# EAGLE design lora-pi-hat (EAGLE 9.5.2)
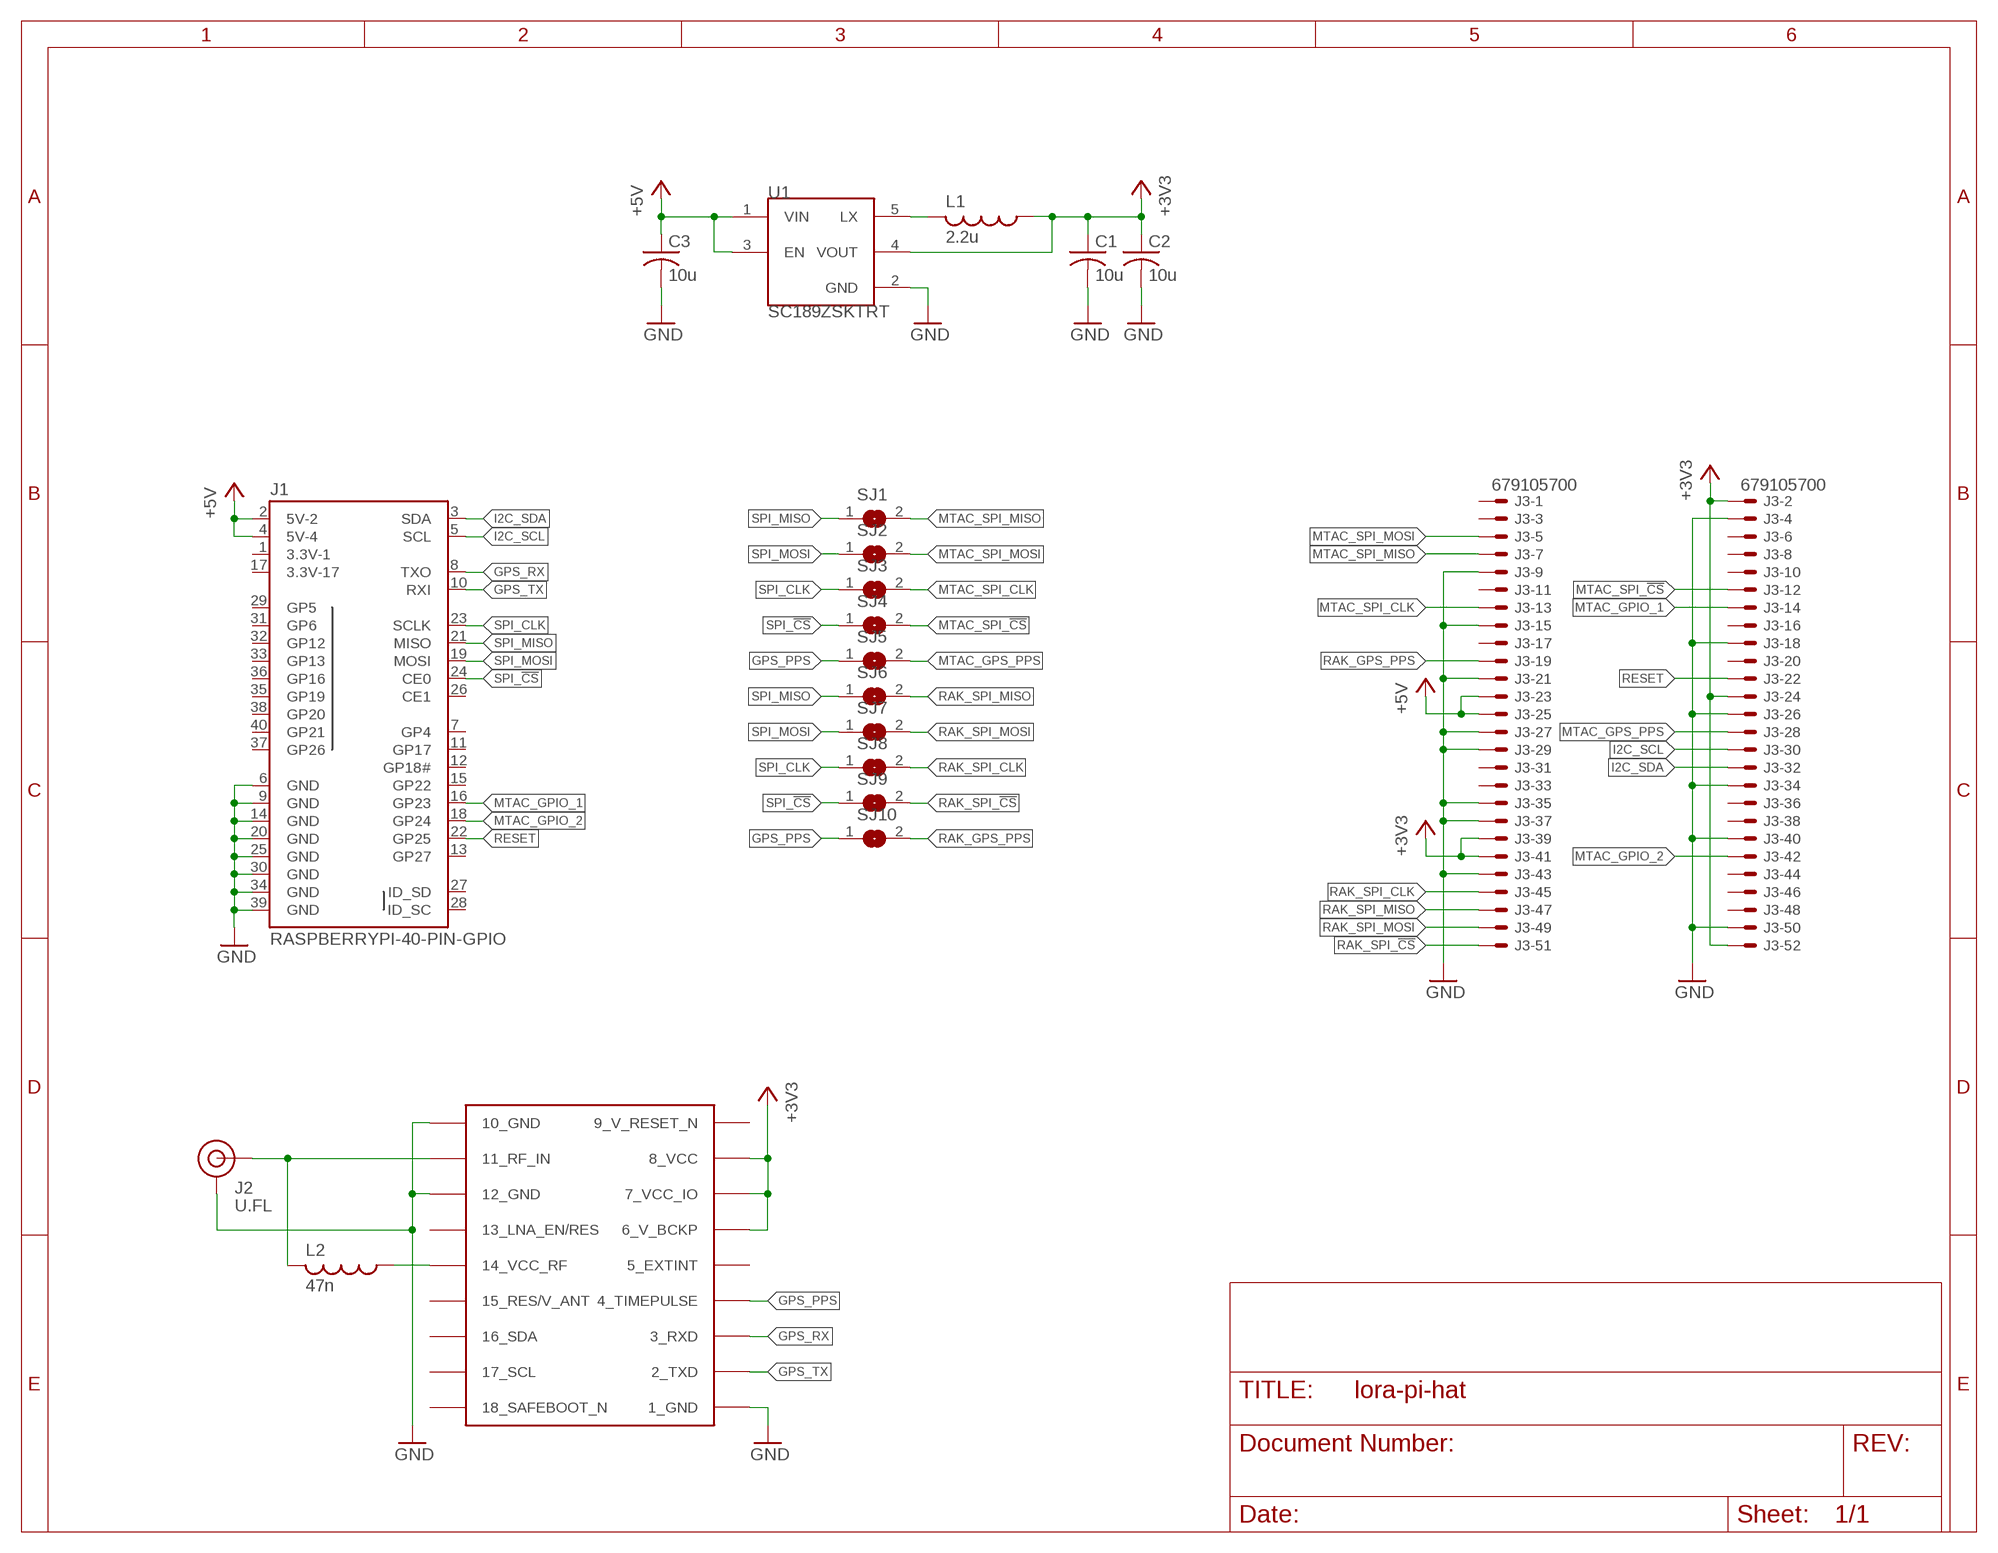
[diagram p0: schematic, sheet 1]

## Parts
C1  10u  C-US-0805  [CAPC2012X125N]
C2  10u  C-US-0805  [CAPC2012X125N]
C3  10u  C-US-0805  [CAPC2012X125N]
J1  RASPBERRYPI-40-PIN-GPIO  RASPBERRYPI-40-PIN-GPIO_PTH_NO_SHROUD  [2X20]
J2  U.FL  U.FL2PIN  [U.FL]
J3  679105700  [679105700]
L1  2.2u  L-US-1210  [INDC3225X250N]
L2  47n  L-US-0805  [INDC2012X125N]
SJ1  SJ  [SJ]
SJ2  SJ  [SJ]
SJ3  SJ  [SJ]
SJ4  SJ  [SJ]
SJ5  SJ  [SJ]
SJ6  SJ  [SJ]
SJ7  SJ  [SJ]
SJ8  SJ  [SJ]
SJ9  SJ  [SJ]
SJ10  SJ  [SJ]
U1  SC189ZSKTRT  [SOT95P280X120-5N]
U2  MAX-M8  [MAX-M8]

## Nets
+3V3 [pwr]: C1.1 C2.1 J3.2 J3.24 J3.39 J3.41 J3.52 L1.1 U1.4(VOUT) U2.6_V_BCKP U2.7_VCC_IO U2.8_VCC
+5V [pwr]: C3.1 J1.2(5V-2) J1.4(5V-4) J3.23 J3.25 U1.1(VIN) U1.3(EN)
GND: C1.2 C2.2 C3.2 J1.6(GND) J1.9(GND) J1.14(GND) J1.20(GND) J1.25(GND) J1.30(GND) J1.34(GND) J1.39(GND) J2.1(GND) J2.2(GND) J3.4 J3.9 J3.15 J3.18 J3.21 J3.26 J3.27 J3.29 J3.34 J3.35 J3.37 J3.40 J3.43 J3.50 U1.2(GND) U2.1_GND U2.10_GND U2.12_GND
GPS_PPS: SJ5.1 SJ10.1 U2.4_TIMEPULSE
GPS_RX: J1.8(TXO) U2.3_RXD
GPS_TX: J1.10(RXI) U2.2_TXD
I2C_SCL: J1.5(SCL) J3.30
I2C_SDA: J1.3(SDA) J3.32
MTAC_GPIO_1: J1.16(GP23) J3.14
MTAC_GPIO_2: J1.18(GP24) J3.42
MTAC_GPS_PPS: J3.28 SJ5.2
MTAC_SPI_!CS: J3.12 SJ4.2
MTAC_SPI_CLK: J3.13 SJ3.2
MTAC_SPI_MISO: J3.7 SJ1.2
MTAC_SPI_MOSI: J3.5 SJ2.2
N$3: L1.2 U1.5(LX)
N$4: L2.1 U2.14_VCC_RF
N$5: J2.FEED(SIGNAL) L2.2 U2.11_RF_IN
RAK_GPS_PPS: J3.19 SJ10.2
RAK_SPI_!CS: J3.51 SJ9.2
RAK_SPI_CLK: J3.45 SJ8.2
RAK_SPI_MISO: J3.47 SJ6.2
RAK_SPI_MOSI: J3.49 SJ7.2
RESET: J1.22(GP25) J3.22
SPI_!CS: J1.24(CE0) SJ4.1 SJ9.1
SPI_CLK: J1.23(SCLK) SJ3.1 SJ8.1
SPI_MISO: J1.21(MISO) SJ1.1 SJ6.1
SPI_MOSI: J1.19(MOSI) SJ2.1 SJ7.1
Unconnected: J1.7(GP4) J1.11(GP17) J1.12(GP18#) J1.13(GP27) J1.15(GP22) J1.26(CE1) J1.27(ID_SD) J1.28(ID_SC) J1.29(GP5) J1.31(GP6) J1.32(GP12) J1.33(GP13) J1.35(GP19) J1.36(GP16) J1.37(GP26) J1.38(GP20) J1.40(GP21) J3.1 J3.3 J3.6 J3.8 J3.10 J3.11 J3.16 J3.17 J3.20 J3.31 J3.33 J3.36 J3.38 J3.44 J3.46 J3.48 U2.5_EXTINT U2.13_LNA_EN(13_LNA_EN/RES) U2.15_V_ANT/RESERVED(15_RES/V_ANT) U2.16_SDA U2.17_SCL U2.18_SAFEBOOT_N

## Power pins joined to a net without a drawn wire
3.3V-1: J1.1(3.3V-1)
3.3V-17: J1.17(3.3V-17)
9_V_RESET_N: U2.9_RESET_N(9_V_RESET_N)

## Library data of the parts
C1-C3 = pi-hat:C-US
J1 = pi-hat:RASPBERRYPI-40-PIN-GPIO: Raspberry Pi GPIO Header 2x20 pin connector, as found on B, B+, A+ models. Both shrouded PTH and SMT versions available. SparkFun Products: GPIO Shrouded Header <https://www.sparkfun.com/products/13054>- PTH SparkFun Pi Wedge (Preassembled) <https://www.sparkfun.com/products/13717>
J2 = SparkFun-Connectors:U.FL2PIN: SMD Antenna Connector - U.FL 2mm height, 3.0mm x 3.0mm receptacle size. SparkFun Products: SparkFun WiFi Shield - ESP8266 <https://www.sparkfun.com/products/13287> SparkFun ESP8266 Thing <https://www.sparkfun.com/products/13231> SparkFun MiniGen - Pro Mini Signal Generator Shield <https://www.sparkfun.com/products/11420>; PROD_ID: CONN-09193; SF_ID: WRL-09144
J3 = con-molex:679105700: MINI PCI EXPRESS CONNECTOR 0.8MM PITCH, 52 CIRCUIT Source: http://www.molex.com/pdm_docs/sd/679105700_sd.pdf; MF: MOLEX; MPN: 67910-5700; OC_FARNELL: unknown; OC_NEWARK: 93M2128
L1 L2 = pi-hat:L-US
SJ1-SJ10 = jumper:SJ: SMD solder JUMPER
U1 = pi-hat:SC189Z
U2 = ublox:MAX-M8: u-blox MAX GNSS module

## Net classes
1 pwr: width 0.305 mm, drill 0.35 mm

## Board
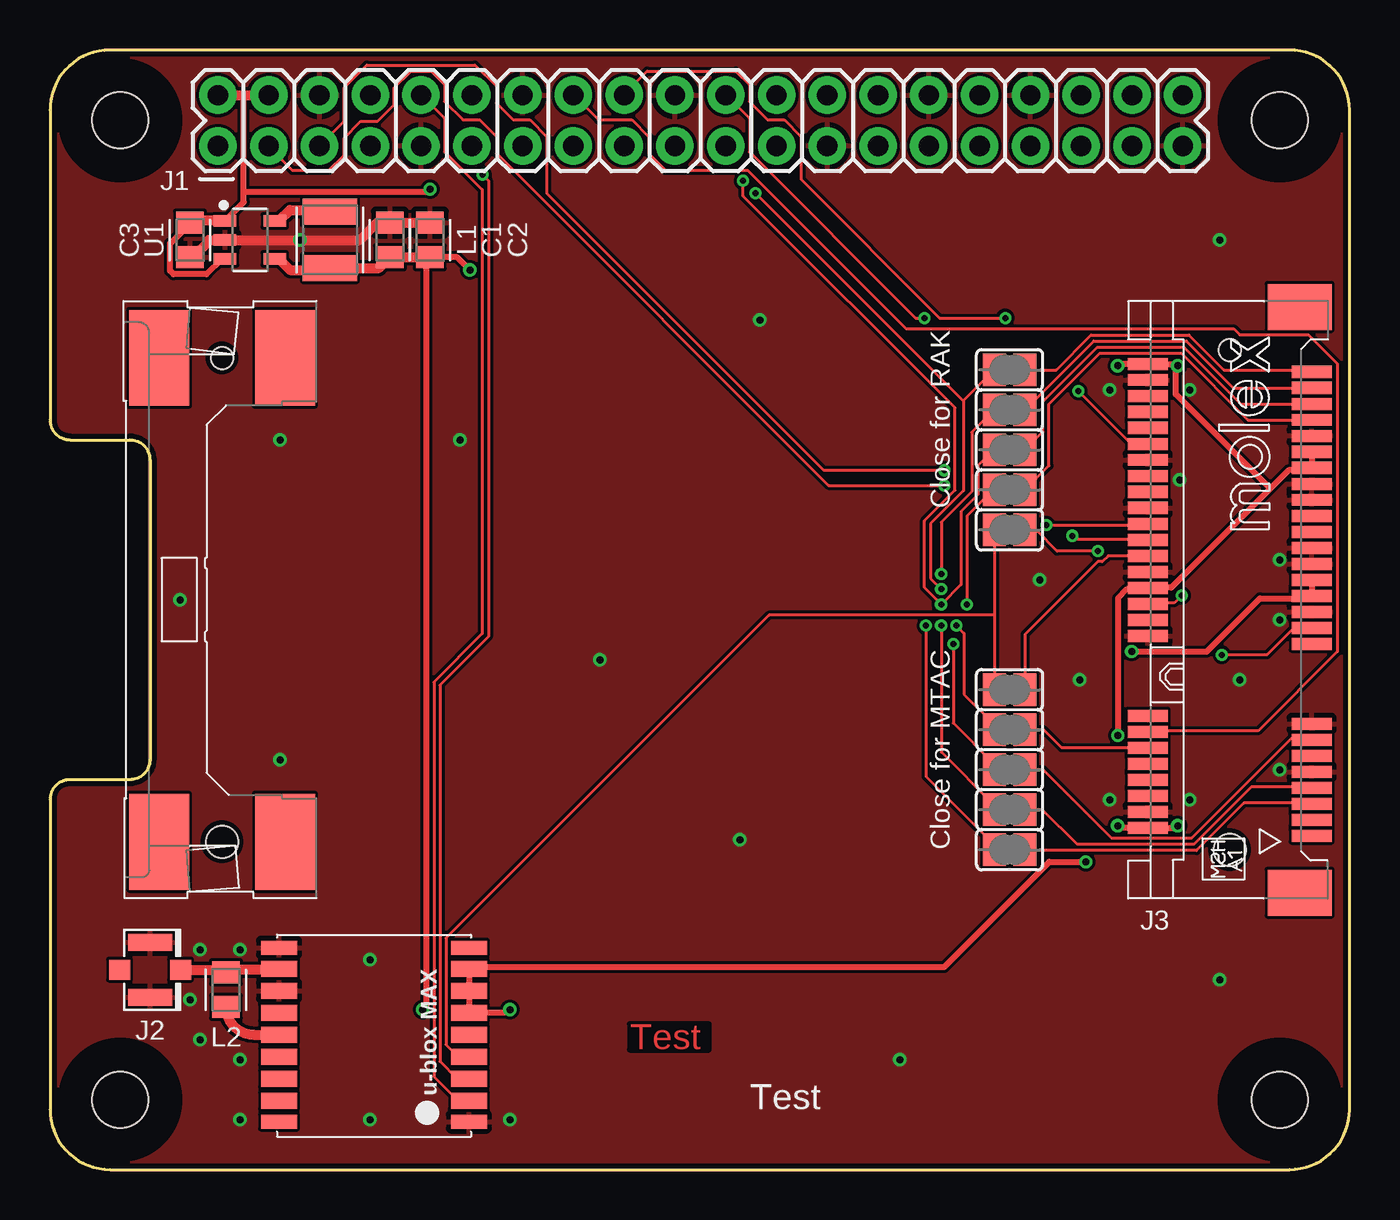
[diagram p1: board, top side]
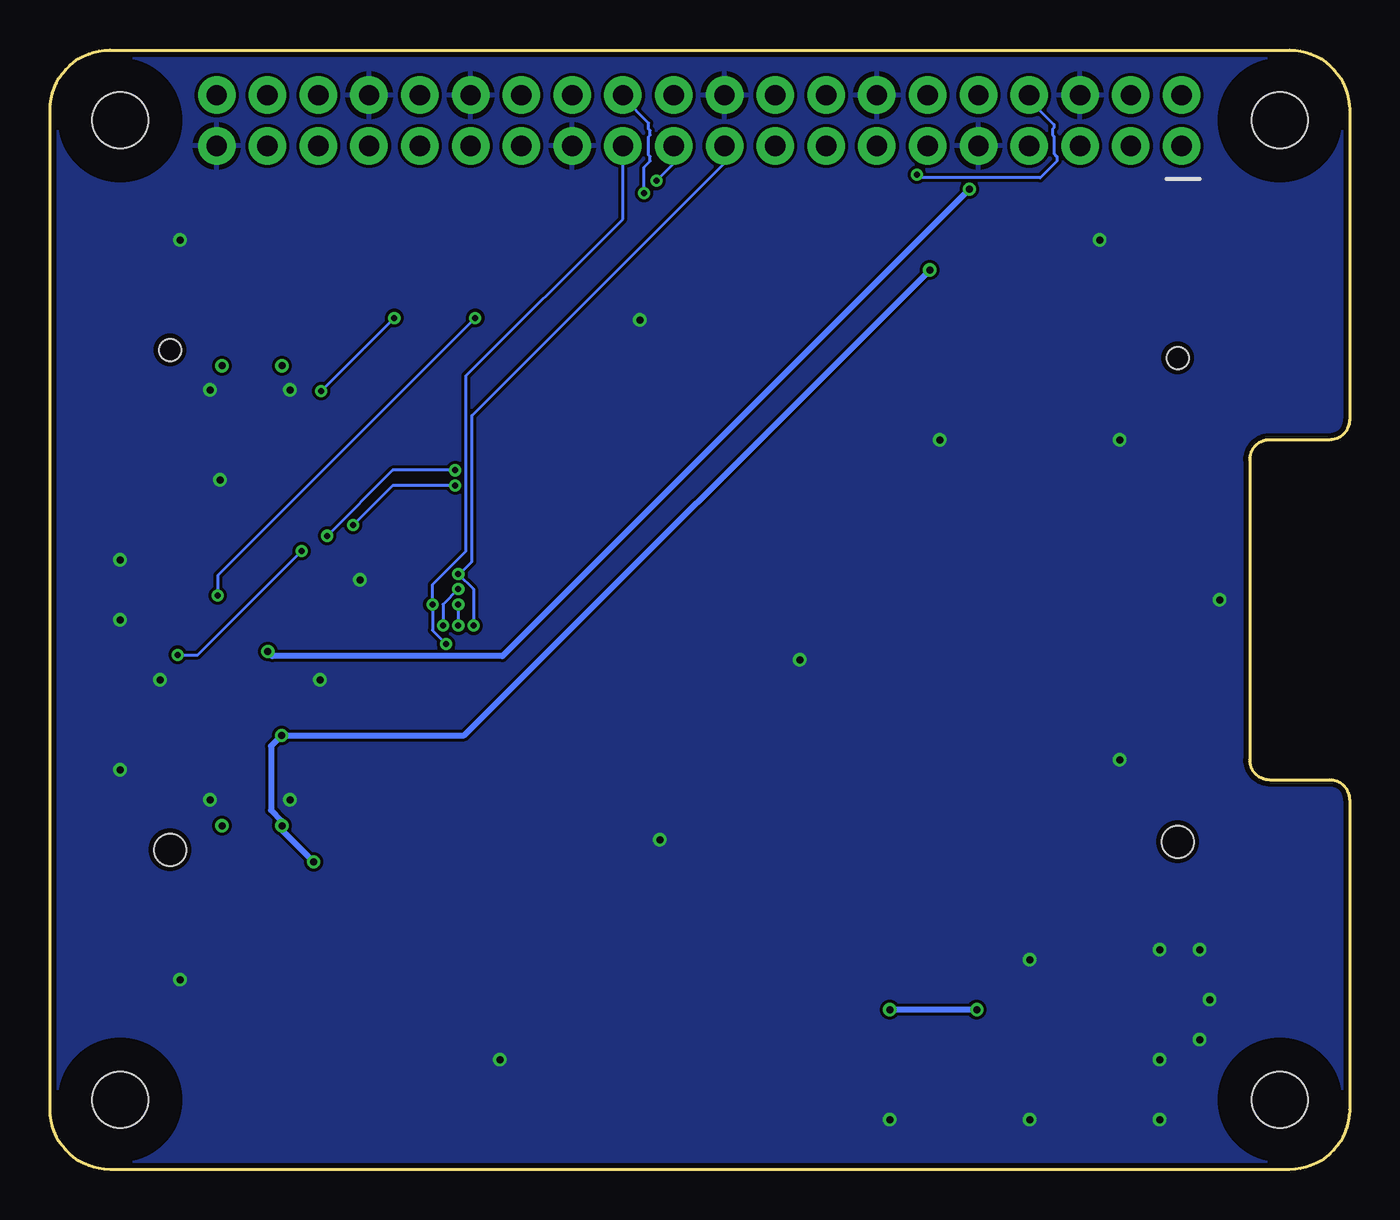
[diagram p2: board, bottom side, seen from below]

Size 65 x 56 mm. Coordinates in mm from the lower left corner, seen from the top.
Outline: 0,3 arc90 3,0 62,0 arc90 65,3 65,53 arc90 62,56 3,56 arc90 0,53 0,37.5 arc90 1,36.5 4,36.5 arc-90 5,35.5 5,20.5 arc-90 4,19.5 1,19.5 arc90 0,18.5 0,3
Copper layers (1*16): Top 0.035mm / dielectric 1.5mm / Bottom 0.035mm
Design rules "default": minimum track width 6mil, minimum drill 0.3mm, track to track 6mil, track to pad 6mil, pad to pad 6mil, via to via 6mil, smd to smd 0mil, copper to edge 10mil, drill to drill 10mil, minimum pad ring 10mil, minimum via ring 6mil, stop-mask expansion 4mil, vias tented up to drill 20mil, thermal gap 10mil
Holes 2.8 mm at 3.5,3.5 3.5,52.5 61.5,52.5 61.5,3.5
tRestrict: area 1.9,51 to 5,54; area 60,51 to 63,54; area 60,1.9 to 63,5; area 1.9,1.9 to 5,5
bRestrict: area 1.9,1.9 to 5,5; area 1.9,51 to 5,54; area 60,1.9 to 63,5; area 60,51 to 63,54

### Footprints (pad centres in the part's own frame; a part is rotated, then mirrored left to right if it is on the bottom)
CAPC2012X125N = smd 1.103 x 1.379: 1 -0.863,0; 2 0.863,0
2X20 = drill 1.016 pad 1.88: 1 0,0; 2 0,2.54; 3 2.54,0; 4 2.54,2.54; 5 5.08,0; 6 5.08,2.54; 7 7.62,0; 8 7.62,2.54; 9 10.16,0; 10 10.16,2.54; 11 12.7,0; 12 12.7,2.54; 13 15.24,0; 14 15.24,2.54; 15 17.78,0; 16 17.78,2.54; 17 20.32,0; 18 20.32,2.54; 19 22.86,0; 20 22.86,2.54; 21 25.4,0; 22 25.4,2.54; 23 27.94,0; 24 27.94,2.54; 25 30.48,0; 26 30.48,2.54; 27 33.02,0; 28 33.02,2.54; 29 35.56,0; 30 35.56,2.54; 31 38.1,0; 32 38.1,2.54; 33 40.64,0; 34 40.64,2.54; 35 43.18,0; 36 43.18,2.54; 37 45.72,0; 38 45.72,2.54; 39 48.26,0; 40 48.26,2.54
U.FL = smd 2.2 x 0.85: 1 0,1.375; 2 0,-1.375 | smd 1.05 x 1: FEED 1.525,0; NC -1.525,0
679105700 = smd 0.6 x 2: 1 0.7,-4.1; 2 1.1,4.1; 3 1.5,-4.1; 4 1.9,4.1; 5 2.3,-4.1; 6 2.7,4.1; 7 3.1,-4.1; 8 3.5,4.1; 9 3.9,-4.1; 10 4.3,4.1; 11 4.7,-4.1; 12 5.1,4.1; 13 5.5,-4.1; 14 5.9,4.1; 15 6.3,-4.1; 16 6.7,4.1; 17 10.3,-4.1; 18 10.7,4.1; 19 11.1,-4.1; 20 11.5,4.1; 21 11.9,-4.1; 22 12.3,4.1; 23 12.7,-4.1; 24 13.1,4.1; 25 13.5,-4.1; 26 13.9,4.1; 27 14.3,-4.1; 28 14.7,4.1; 29 15.1,-4.1; 30 15.5,4.1; 31 15.9,-4.1; 32 16.3,4.1; 33 16.7,-4.1; 34 17.1,4.1; 35 17.5,-4.1; 36 17.9,4.1; 37 18.3,-4.1; 38 18.7,4.1; 39 19.1,-4.1; 40 19.5,4.1; 41 19.9,-4.1; 42 20.3,4.1; 43 20.7,-4.1; 44 21.1,4.1; 45 21.5,-4.1; 46 21.9,4.1; 47 22.3,-4.1; 48 22.7,4.1; 49 23.1,-4.1; 50 23.5,4.1; 51 23.9,-4.1; 52 24.3,4.1 | smd 2.3 x 3.2: M1 27.15,-3.5; M2 -2.15,-3.5 | smd 4.8 x 3: M3 0.4,47.25; M4 0.4,53.55; M5 24.6,47.25; M6 24.6,53.55 | hole 1.6: 0,0; 0.4,50.4 | hole 1.1: 25,0; 24.6,50.4
INDC3225X250N = smd 1.296 x 2.715: 1 -1.41,0; 2 1.41,0
INDC2012X125N = smd 1.103 x 1.379: 1 -0.863,0; 2 0.863,0
SJ = smd 1.168 x 1.6: 1 -0.762,0; 2 0.762,0
SOT95P280X120-5N = smd 1.119 x 0.584: 1 -1.246,0.95; 2 -1.246,0; 3 -1.246,-0.95; 4 1.246,-0.95; 5 1.246,0.95
MAX-M8 = smd 1.8 x 0.7: 1_GND 4.95,-4.4; 9_RESET_N 4.95,4.3; 10_GND -4.55,4.3; 18_SAFEBOOT_N -4.55,-4.4 | smd 1.8 x 0.8: 2_TXD 4.95,-3.35; 3_RXD 4.95,-2.25; 4_TIMEPULSE 4.95,-1.15; 5_EXTINT 4.95,-0.05; 6_V_BCKP 4.95,1.05; 7_VCC_IO 4.95,2.15; 8_VCC 4.95,3.25; 11_RF_IN -4.55,3.25; 12_GND -4.55,2.15; 13_LNA_EN -4.55,1.05; 14_VCC_RF -4.55,-0.05; 15_V_ANT/RESERVED -4.55,-1.15; 16_SDA -4.55,-2.25; 17_SCL -4.55,-3.35

### Placement (x,y rotation side)
C1  17,46.5 90 top
C2  19,46.5 90 top
C3  7,46.5 270 top
J1  8.4,51.2 0 top
J2  5,10 0 top
J3  59,16 90 top
L1  14,46.5 90 top
L2  8.8,9 90 top
SJ1  48,18 0 top
SJ2  48,16 0 top
SJ3  48,20 0 top
SJ4  48,22 0 top
SJ5  48,24 0 top
SJ6  48,36 0 top
SJ7  48,38 0 top
SJ8  48,34 0 top
SJ9  48,40 0 top
SJ10  48,32 0 top
U1  10,46.5 0 top
U2  16,6.8 0 top

### Tracks (layer width: path | path; a pad name or v marks a point on that pad's centre or on a via)
+3V3  (via drill 0.35)
  Top 0.305: v56.4,17.2 56.3,17.1 J3.2 53.5,17.1 v53.4,17.2 | v53.4,40.2 53.5,40.3 J3.52 56.3,40.3 v56.4,40.2 56.31,40.08 56.31,38.79 61.04,34.06 | J3.41 J3.39 63.02,34.98 61.95,34.98 61.04,34.06 | 61.04,34.06 56.08,29.11 54.94,29.11 J3.24 54.79,29.03 53.87,29.03 53.42,28.57 v53.42,21.72 | v51.82,15.39 49.99,15.39 44.73,10.13 21.03,10.13 U2.8_VCC U2.7_VCC_IO U2.6_V_BCKP 22.85,7.85 v23,8 | v21,45 20.36,45.64 C2.1 18.82,45.41 18.82,8.18 v18.65,8
  Top 0.508: U1.4 11.45,45.55 12,45 13.91,45 L1.1 16.45,45.09 C1.1 C2.1
  Bottom 0.305: v51.82,15.39 53.42,16.99 53.42,17.07 v53.4,17.2 53.42,17.22 53.42,17.45 53.95,17.98 53.95,21.18 v53.42,21.72 44.28,21.72 v21,45 | v18.65,8 v23,8
+5V  (via drill 0.35)
  Top 0.305: U1.1 9.7,48.39 9.7,48.92 | 9.7,53.74 9.7,53.73 9.7,48.92 | C3.1 7,47.31 6.01,46.31 6.01,44.96 6.18,44.78 7.82,44.78 8.59,45.55 U1.3 | J3.25 J3.23 63.02,28.57 60.52,28.57 57.85,25.91 v54.1,25.91 | v19.01,49.03 18.9,48.92 9.7,48.92
  Top 0.508: U1.1 7.09,47.45 C3.1 | J1.2 9.7,53.74 J1.4
  Bottom 0.305: v54.1,25.91 53.87,25.68 42.37,25.68 v19.01,49.03
GND  (via drill 0.35)
  Top 0.508: 7.95,46.5 8,46.5 | 8,46.5 U1.2 15.5,46.5 16.36,47.36 C1.2 C2.2 | 8,46.5 7.14,45.64 C3.2
  other vias: 53,39 57,39 57,18.5 53,18.5 61.5,20 23,2.5 16,2.5 16,10.5 9.5,11 7.5,11 7,8.5 7.5,6.5 9.5,5.5 9.5,2.5 12.5,46.5 61.5,27.5 61.5,30.5 56.5,34.5 59.5,24.5 51.5,24.5 49.5,29.5 34.5,16.5 27.5,25.5 20.5,36.5 11.5,36.5 11.5,20.5 6.5,28.5 35.5,42.5 58.5,46.5 58.5,9.5 42.5,5.5
  pour Bottom: 0,3 arc90 3,0 62,0 arc90 65,3 65,53 arc90 62,56 3,56 arc90 0,53 0,37.5 arc90 1,36.5 4,36.5 arc-90 5,35.5 5,20.5 arc-90 4,19.5 1,19.5 arc90 0,18.5
  pour Top: 0,3 arc90 3,0 62,0 arc90 65,3 65,53 arc90 62,56 3,56 arc90 0,53 0,37.5 arc90 1,36.5 4,36.5 arc-90 5,35.5 5,20.5 arc-90 4,19.5 1,19.5 arc90 0,18.5
GPS_PPS
  Top 0.152: 47.24,27.74 47.24,31.93 SJ10.1 | 47.24,27.74 SJ5.1 | 47.24,27.74 35.97,27.74 19.81,11.58 19.81,6.25 20.34,5.71 20.88,5.71 U2.4_TIMEPULSE
GPS_RX  (via drill 0.3)
  Top 0.152: v21.64,49.76 21.93,49.47 21.93,26.65 19.51,24.23 19.51,5.41 20.34,4.57 20.88,4.57 U2.3_RXD
  Bottom 0.152: v21.64,49.76 21.49,49.61 15.47,49.61 14.63,50.44 14.63,50.67 14.78,50.83 14.78,51.66 14.86,51.74 14.86,52.05 14.78,52.12 14.78,52.27 16,53.49 16,53.72 J1.8
GPS_TX
  Top 0.152: U2.2_TXD 20.88,3.5 20.34,3.5 19.2,4.65 19.2,24.38 21.62,26.8 21.62,49.01 19.74,50.9 19.74,52.58 18.59,53.72 J1.10
I2C_SCL  (via drill 0.3)
  Top 0.152: v51.13,31.7 51.28,31.55 54.86,31.55 J3.30 | v44.73,34.98 38.69,34.98 24.84,48.83 24.84,51.66 24,52.5 23.16,52.5 22.33,53.34 22.33,54.18 21.26,55.24 15.85,55.24 14.71,54.1 14.71,52.43 J1.5
  Bottom 0.152: v51.13,31.7 47.85,34.98 v44.73,34.98
I2C_SDA  (via drill 0.3)
  Top 0.152: v49.84,32.23 54.86,32.23 J3.32 | v44.73,34.21 38.94,34.21 22.33,50.83 22.33,51.66 21.49,52.5 20.65,52.5 19.74,53.42 19.74,54.25 19.05,54.94 18.06,54.94 17.22,54.1 17.22,53.26 16.38,52.43 15.54,52.43 14.71,51.59 14.71,50.75 13.95,49.99 12.12,49.99 10.97,51.13 J1.3
  Bottom 0.152: v49.84,32.23 47.85,34.21 v44.73,34.21
MTAC_GPIO_1
  Top 0.152: J3.14 54.94,21.95 60.43,21.95 64.39,25.91 64.39,40.31 62.94,41.76 59.51,41.76 59.21,42.06 42.82,42.06 34.9,49.99 30.79,49.99 29.95,50.83 29.95,51.66 29.11,52.5 27.43,52.5 26.21,53.72 J1.16
MTAC_GPIO_2  (via drill 0.3)
  Top 0.152: v51.44,38.94 54.03,36.35 54.86,36.35 J3.42 | v47.78,42.6 44.5,42.6 37.57,49.52 37.57,51.66 36.73,52.5 35.89,52.5 34.98,53.42 34.98,54.25 34.29,54.94 29.87,54.94 28.73,53.8 J1.18
  Bottom 0.152: v47.78,42.6 v51.44,38.94
MTAC_GPS_PPS
  Top 0.152: SJ5.2 48.77,26.77 52.41,30.41 52.64,30.41 52.93,30.7 J3.28
MTAC_SPI_!CS
  Top 0.152: J3.12 50.6,21.1 49.7,22 SJ4.2
MTAC_SPI_CLK
  Top 0.152: J3.13 63.07,21.53 62.05,21.53 57.09,16.57 53.1,16.57 49.68,20 SJ3.2
MTAC_SPI_MISO
  Top 0.152: SJ1.2 49.65,18 51.38,16.27 57.22,16.27 60.08,19.13 63.07,19.13 J3.7
MTAC_SPI_MOSI
  Top 0.152: J3.5 63.07,18.33 59.71,18.33 57.35,15.96 48.8,15.96 SJ2.2
N$3
  Top 0.508: U1.5 11.45,47.45 12,48 13.91,48 L1.2
N$4
  Top 0.508: L2.1 arc90 10.19,6.75 U2.14_VCC_RF
N$5
  Top 0.508: J2.FEED 8.66,10 | 8.66,10 L2.2 | U2.11_RF_IN 11.4,10 8.66,10
RAK_GPS_PPS  (via drill 0.3)
  Top 0.152: v52.42,30.94 50.37,30.94 49.38,31.93 48.77,31.93 SJ10.2 | v58.61,25.75 60.87,25.75 62.18,27.05 63.09,27.05 J3.19
  Bottom 0.152: v58.61,25.75 57.61,25.75 v52.42,30.94
RAK_SPI_!CS
  Top 0.152: J3.51 63,40 58.72,40 56.97,41.74 52.07,41.74 50.33,40 SJ9.2
RAK_SPI_CLK
  Top 0.152: J3.45 59.92,37.5 56.59,40.83 52.51,40.83 49.97,38.3 49.97,35.21 SJ8.2
RAK_SPI_MISO
  Top 0.152: J3.47 59.55,38.3 56.72,41.13 52.38,41.13 49.67,38.42 49.67,36.91 SJ6.2
RAK_SPI_MOSI
  Top 0.152: J3.49 59.19,39.1 56.85,41.44 52.2,41.44 SJ7.2
RESET  (via drill 0.3)
  Top 0.152: v56.61,28.72 56.24,28.35 54.94,28.35 J3.22 | v43.73,42.6 43.28,42.6 34.98,50.9 34.98,52.58 33.83,53.72 J1.22
  Bottom 0.152: v56.61,28.72 56.61,29.72 v43.73,42.6
SPI_!CS  (via drill 0.3)
  Top 0.152: v45.34,27.2 45.72,26.82 45.72,23.77 47.17,22.33 47.17,22.02 SJ4.1 | v44.58,29.03 44.04,29.57 44.04,32.31 45.7,33.96 45.7,38.46 | 45.7,38.46 47.17,39.93 SJ9.1 | 45.7,38.46 45.68,38.45 v35.28,48.84
  Bottom 0.152: v45.34,27.2 45.34,28.27 v44.58,29.03 | v35.28,48.84 35.28,50.14 34.98,50.44 34.98,50.67 35.05,50.75 35.05,51.66 34.98,51.74 34.98,51.97 35.05,52.05 35.05,52.35 36.27,53.57 36.27,53.72 J1.24
SPI_CLK  (via drill 0.3)
  Top 0.152: v45.19,26.29 45.19,22.33 47.17,20.34 47.17,20.04 SJ3.1 | v45.87,28.27 45.87,32.69 47.17,33.98 SJ8.1
  Bottom 0.152: v45.19,26.29 45.87,26.98 v45.87,28.27 45.87,29.26 44.2,30.94 44.2,39.7 36.35,47.55 36.35,51.13 J1.23
SPI_MISO  (via drill 0.3)
  Top 0.152: v44.58,27.2 44.58,20.88 47.17,18.29 47.17,18.06 SJ1.1 | SJ6.1 47.17,35.97 46.41,35.2 46.41,33.76 45.57,32.92 45.57,29.26 v44.58,28.27 43.74,29.11 43.74,32.46 45.26,33.98 45.26,38.1 34.67,48.7 v34.67,49.45
  Bottom 0.152: v44.58,28.27 v44.58,27.2 | v34.67,49.45 33.83,50.29 33.83,51.13 J1.21
SPI_MOSI  (via drill 0.3)
  Top 0.152: v43.81,27.2 43.81,19.66 47.17,16.31 47.17,16 SJ2.1 | v44.58,29.79 44.58,32.38 46.1,33.91 46.1,36.88 47.17,37.95 SJ7.1
  Bottom 0.152: v43.81,27.2 43.81,29.03 v44.58,29.79 44.5,29.79 43.89,30.4 43.89,37.72 31.32,50.29 31.32,51.13 J1.19

### Text on the board
Top: Test
tNames: Close for RAK | Close for MTAC | Test
tStop: Test
tRestrict: Test